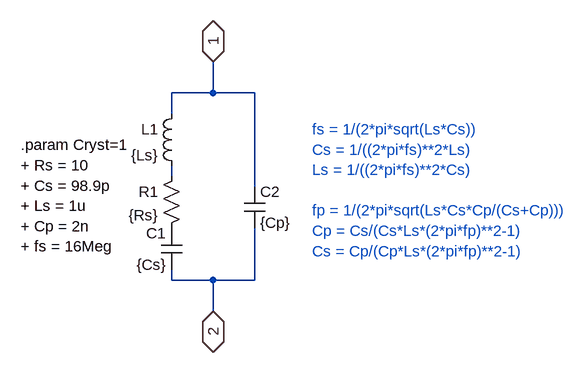
[diagram p0: schematic Draft3.asc]
Draft3.asc, the LTspice schematic file:
Version 4
SHEET 1 928 680
WIRE 208 -448 208 -496
WIRE 208 -448 144 -448
WIRE 272 -448 208 -448
WIRE 144 -416 144 -448
WIRE 144 -320 144 -336
WIRE 272 -304 272 -448
WIRE 144 -160 144 -176
WIRE 208 -160 144 -160
WIRE 272 -160 272 -240
WIRE 272 -160 208 -160
WIRE 208 -112 208 -160
FLAG 208 -496 1
IOPIN 208 -496 BiDir
FLAG 208 -112 2
IOPIN 208 -112 BiDir
SYMBOL res 160 -336 M0
SYMATTR InstName R1
SYMATTR Value {Rs}
SYMBOL cap 160 -240 M0
SYMATTR InstName C1
SYMATTR Value {Cs}
SYMBOL cap 256 -304 R0
SYMATTR InstName C2
SYMATTR Value {Cp}
SYMBOL ind 160 -432 M0
SYMATTR InstName L1
SYMATTR Value {Ls}
TEXT -88 -368 Left 2 !.param Cryst=1\n+ Rs = 10\n+ Cs = 98.9p\n+ Ls = 1u\n+ Cp = 2n\n+ fs = 16Meg
TEXT 360 -392 Left 2 ;fs = 1/(2*pi*sqrt(Ls*Cs))\nCs = 1/((2*pi*fs)**2*Ls)\nLs = 1/((2*pi*fs)**2*Cs)\n \nfp = 1/(2*pi*sqrt(Ls*Cs*Cp/(Cs+Cp)))\nCp = Cs/(Cs*Ls*(2*pi*fp)**2-1)\nCs = Cp/(Cp*Ls*(2*pi*fp)**2-1)

The netlist it stands for:
* Draft3.asc
R1 N001 P001 {Rs}
C1 P001 2 {Cs}
C2 1 2 {Cp}
L1 1 N001 {Ls}
.param Cryst=1
+ Rs = 10
+ Cs = 98.9p
+ Ls = 1u
+ Cp = 2n
+ fs = 16Meg
* fs = 1/(2*pi*sqrt(Ls*Cs))
* Cs = 1/((2*pi*fs)**2*Ls)
* Ls = 1/((2*pi*fs)**2*Cs)
* fp = 1/(2*pi*sqrt(Ls*Cs*Cp/(Cs+Cp)))
* Cp = Cs/(Cs*Ls*(2*pi*fp)**2-1)
* Cs = Cp/(Cp*Ls*(2*pi*fp)**2-1)
.backanno
.end